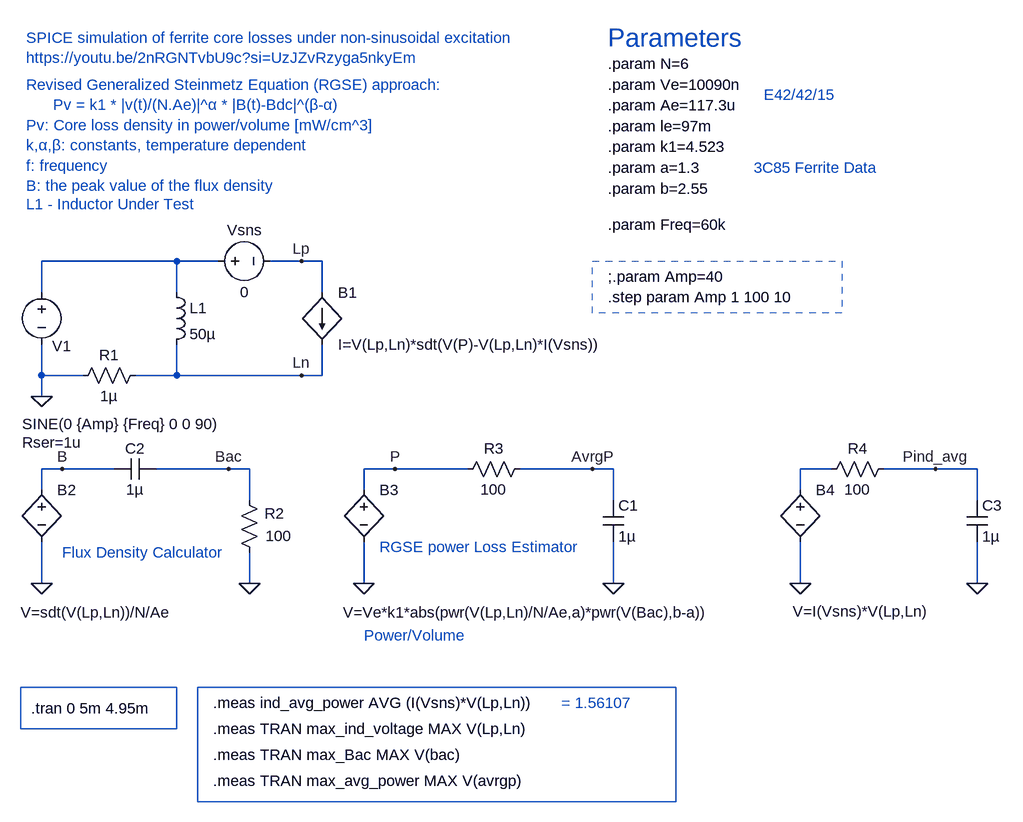
[diagram p0: schematic 07-ferrite_core_loss_max_temp_non-sinsoidal.asc]
07-ferrite_core_loss_max_temp_non-sinsoidal.asc, the LTspice schematic file:
Version 4
SHEET 1 2176 1520
WIRE 96 528 -112 528
WIRE 160 528 96 528
WIRE 288 528 240 528
WIRE 320 528 288 528
WIRE -112 576 -112 528
WIRE 96 576 96 528
WIRE 320 576 320 528
WIRE -112 704 -112 656
WIRE -48 704 -112 704
WIRE 96 704 96 656
WIRE 96 704 32 704
WIRE 288 704 96 704
WIRE 320 704 320 656
WIRE 320 704 288 704
WIRE -112 736 -112 704
WIRE -80 848 -112 848
WIRE 0 848 -80 848
WIRE 176 848 64 848
WIRE 208 848 176 848
WIRE 432 848 384 848
WIRE 544 848 432 848
WIRE 736 848 624 848
WIRE 768 848 736 848
WIRE 1104 848 1056 848
WIRE 1264 848 1184 848
WIRE 1328 848 1264 848
WIRE -112 880 -112 848
WIRE 384 880 384 848
WIRE 1056 880 1056 848
WIRE 208 896 208 848
WIRE 768 896 768 848
WIRE 1328 896 1328 848
WIRE -112 1024 -112 960
WIRE 208 1024 208 976
WIRE 384 1024 384 960
WIRE 768 1024 768 960
WIRE 1056 1024 1056 960
WIRE 1328 1024 1328 960
FLAG -112 736 0
FLAG 384 1024 0
FLAG 432 848 P
FLAG -112 1024 0
FLAG 176 848 Bac
FLAG 208 1024 0
FLAG 288 528 Lp
FLAG 288 704 Ln
FLAG 736 848 AvrgP
FLAG 768 1024 0
FLAG -80 848 B
FLAG 1056 1024 0
FLAG 1264 848 Pind_avg
FLAG 1328 1024 0
SYMBOL voltage -112 560 R0
WINDOW 0 16 99 Left 2
WINDOW 3 -30 219 Left 2
WINDOW 123 0 0 Left 0
WINDOW 39 -30 247 Left 2
SYMATTR InstName V1
SYMATTR Value SINE(0 {Amp} {Freq} 0 0 90)
SYMATTR SpiceLine Rser=1u
SYMBOL ind 80 560 R0
SYMATTR InstName L1
SYMATTR Value 50µ
SYMATTR SpiceLine Rser=1
SYMBOL bv 384 864 R0
WINDOW 3 -32 205 Left 2
SYMATTR Value V=Ve*k1*abs(pwr(V(Lp,Ln)/N/Ae,a)*pwr(V(Bac),b-a))
SYMATTR InstName B3
SYMBOL bv -112 864 R0
WINDOW 3 -32 205 Left 2
SYMATTR Value V=sdt(V(Lp,Ln))/N/Ae
SYMATTR InstName B2
SYMBOL res 224 992 R180
WINDOW 0 -38 76 Left 2
WINDOW 3 -49 41 Left 2
SYMATTR InstName R2
SYMATTR Value 100
SYMBOL cap 64 832 R90
WINDOW 0 0 32 VBottom 2
WINDOW 3 32 32 VTop 2
SYMATTR InstName C2
SYMATTR Value 1µ
SYMBOL res 48 688 R90
WINDOW 0 0 56 VBottom 2
WINDOW 3 32 56 VTop 2
SYMATTR InstName R1
SYMATTR Value 1µ
SYMBOL bi 320 576 R0
SYMATTR InstName B1
SYMATTR Value I=V(Lp,Ln)*sdt(V(P)-V(Lp,Ln)*I(Vsns))
SYMBOL res 640 832 R90
WINDOW 0 0 56 VBottom 2
WINDOW 3 32 56 VTop 2
SYMATTR InstName R3
SYMATTR Value 100
SYMBOL cap 752 896 R0
SYMATTR InstName C1
SYMATTR Value 1µ
SYMBOL bv 1056 864 R0
WINDOW 3 -12 203 Left 2
SYMATTR Value V=I(Vsns)*V(Lp,Ln)
SYMATTR InstName B4
SYMBOL res 1200 832 R90
WINDOW 0 0 56 VBottom 2
WINDOW 3 32 56 VTop 2
SYMATTR InstName R4
SYMATTR Value 100
SYMBOL cap 1312 896 R0
SYMATTR InstName C3
SYMATTR Value 1µ
SYMBOL voltage 144 528 R270
WINDOW 0 32 56 VTop 2
WINDOW 3 -32 56 VBottom 2
SYMATTR InstName Vsns
SYMATTR Value 0
TEXT -136 184 Left 2 ;SPICE simulation of ferrite core losses under non-sinusoidal excitation\nhttps://youtu.be/2nRGNTvbU9c?si=UzJZvRzyga5nkyEm
TEXT -136 256 Left 2 ;Revised Generalized Steinmetz Equation (RGSE) approach:\n      Pv = k1 * |v(t)/(N.Ae)|^α * |B(t)-Bdc|^(β-α)\nPv: Core loss density in power/volume [mW/cm^3]\nk,α,β: constants, temperature dependent\nf: frequency\nB: the peak value of the flux density
TEXT 760 224 Left 2 !.param N=6
TEXT 760 184 Left 4 ;Parameters
TEXT 760 256 Left 2 !.param Ve=10090n
TEXT 760 288 Left 2 !.param Ae=117.3u
TEXT 760 320 Left 2 !.param le=97m
TEXT 760 352 Left 2 !.param k1=4.523
TEXT 760 384 Left 2 !.param a=1.3
TEXT 760 416 Left 2 !.param b=2.55
TEXT 760 472 Left 2 !.param Freq=60k
TEXT 760 552 Left 2 !;.param Amp=40\n.step param Amp 1 100 10
TEXT 1000 272 Left 2 ;E42/42/15
TEXT 984 384 Left 2 ;3C85 Ferrite Data
TEXT -128 1216 Left 2 !.tran 0 5m 4.95m
TEXT 408 968 Left 2 ;RGSE power Loss Estimator
TEXT -80 976 Left 2 ;Flux Density Calculator
TEXT 384 1104 Left 2 ;Power/Volume
TEXT -136 440 Left 2 ;L1 - Inductor Under Test
TEXT 152 1208 Left 2 !.meas ind_avg_power AVG (I(Vsns)*V(Lp,Ln))
TEXT 688 1208 Left 2 ;= 1.56107
TEXT 152 1248 Left 2 !.meas TRAN max_ind_voltage MAX V(Lp,Ln)
TEXT 152 1288 Left 2 !.meas TRAN max_Bac MAX V(bac)
TEXT 152 1328 Left 2 !.meas TRAN max_avg_power MAX V(avrgp)
RECTANGLE Normal 96 1248 -144 1184
RECTANGLE Normal 864 1360 128 1184
RECTANGLE Normal 1120 608 736 528 1

The netlist it stands for:
* 07-ferrite_core_loss_max_temp_non-sinsoidal.asc
V1 N001 0 SINE(0 {Amp} {Freq} 0 0 90) Rser=1u
L1 N001 Ln 50µ Rser=1
B3 P 0 V=Ve*k1*abs(pwr(V(Lp,Ln)/N/Ae,a)*pwr(V(Bac),b-a))
B2 B 0 V=sdt(V(Lp,Ln))/N/Ae
R2 0 Bac 100
C2 Bac B 1µ
R1 Ln 0 1µ
B1 Lp Ln I=V(Lp,Ln)*sdt(V(P)-V(Lp,Ln)*I(Vsns))
R3 AvrgP P 100
C1 AvrgP 0 1µ
B4 N002 0 V=I(Vsns)*V(Lp,Ln)
R4 Pind_avg N002 100
C3 Pind_avg 0 1µ
Vsns N001 Lp 0
* SPICE simulation of ferrite core losses under non-sinusoidal excitation
* https://youtu.be/2nRGNTvbU9c?si=UzJZvRzyga5nkyEm
* Revised Generalized Steinmetz Equation (RGSE) approach:
*       Pv = k1 * |v(t)/(N.Ae)|^α * |B(t)-Bdc|^(β-α)
* Pv: Core loss density in power/volume [mW/cm^3]
* k,α,β: constants, temperature dependent
* f: frequency
* B: the peak value of the flux density
.param N=6
* Parameters
.param Ve=10090n
.param Ae=117.3u
.param le=97m
.param k1=4.523
.param a=1.3
.param b=2.55
.param Freq=60k
;.param Amp=40
.step param Amp 1 100 10
* E42/42/15
* 3C85 Ferrite Data
.tran 0 5m 4.95m
* RGSE power Loss Estimator
* Flux Density Calculator
* Power/Volume
* L1 - Inductor Under Test
.meas ind_avg_power AVG (I(Vsns)*V(Lp,Ln))
* = 1.56107
.meas TRAN max_ind_voltage MAX V(Lp,Ln)
.meas TRAN max_Bac MAX V(bac)
.meas TRAN max_avg_power MAX V(avrgp)
.backanno
.end